# Altium schematic sheet Power.SchDoc: Power
size A4; Organization: Altium Limited; Address1: L3, 12a Rodborough Rd; Address2: Frenchs Forest; Address3: NSW; Address4: Australia 2086
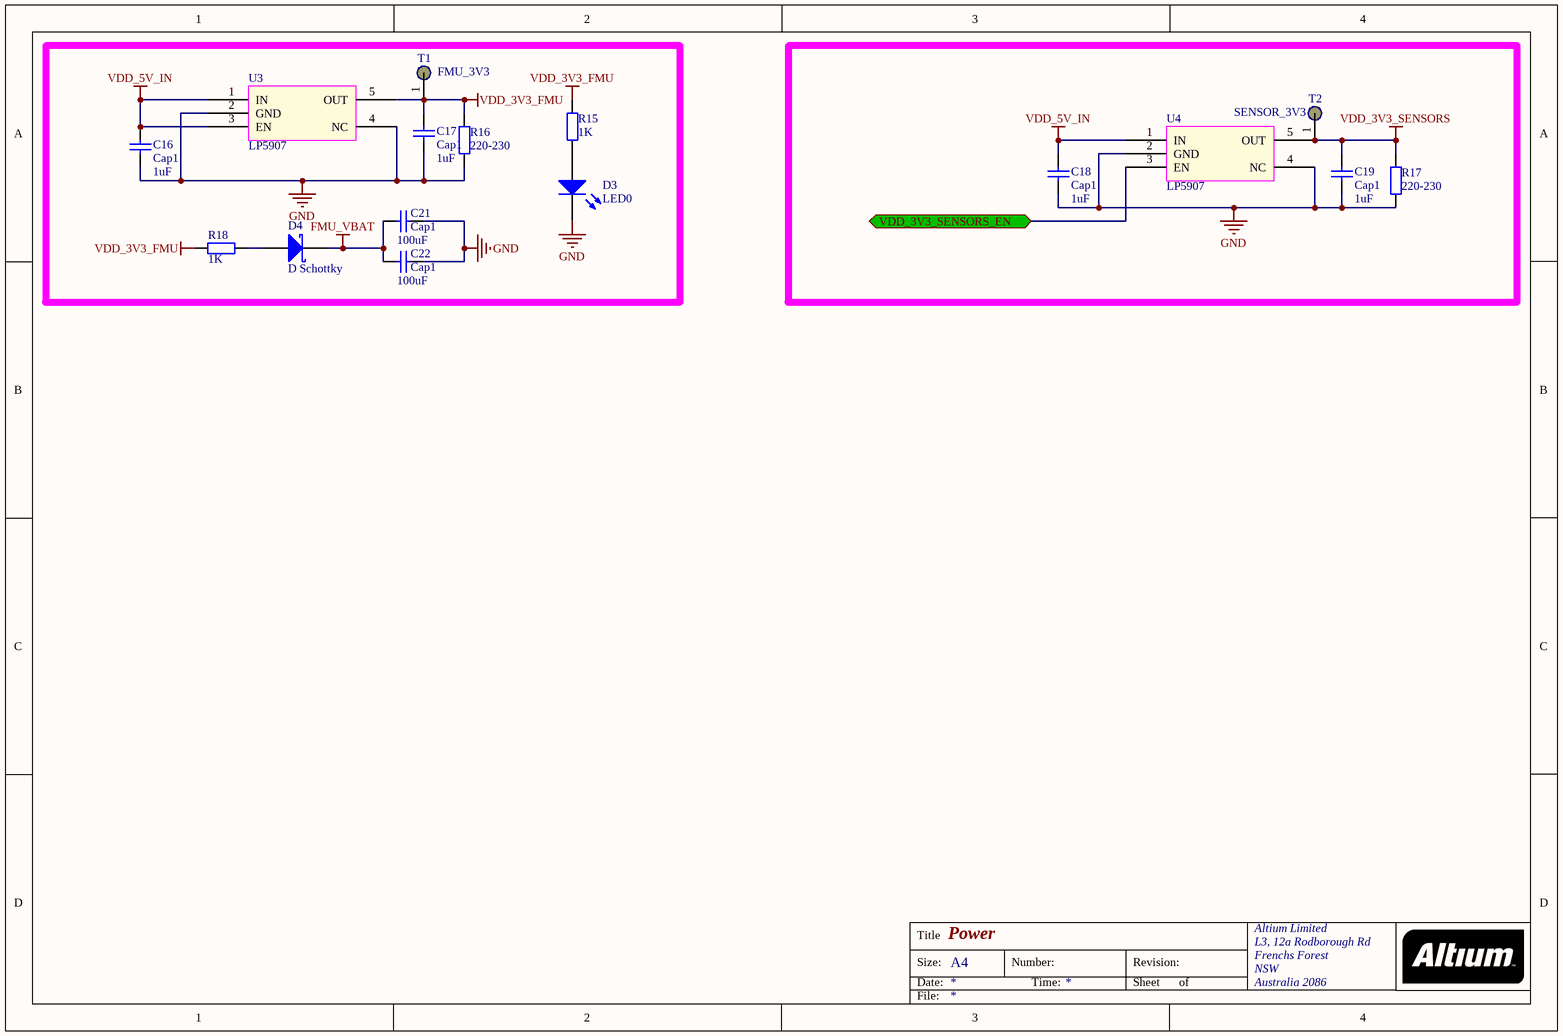
[diagram p0: Power.SchDoc]

## Parts
C16  Cap1  value 1uF  [0603AC]
C17  Cap1  value 1uF  [0603AC]
C18  Cap1  value 1uF  [0603AC]
C19  Cap1  value 1uF  [0603AC]
C21  Cap1  value 100uF  [0805C]
C22  Cap1  value 100uF  [0805C]
D3  LED0  [LED_R]
D4  D Schottky  [DO-214]
R15  value 1K  [0603AR]  (hidden comment: Resist)
R16  value 220-230  [0603AR]  (hidden comment: Resist)
R17  value 220-230  [0603AR]  (hidden comment: Resist)
R18  value 1K  [0603AR]  (hidden comment: Resist)
T1  FMU_3V3  [TAB]
T2  SENSOR_3V3  [TAB]
U3  LP5907
U4  LP5907

## Ports
VDD_3V3_SENSORS_EN

## Nets
FMU_VBAT: C21.2 C22.2 D4.2(K)
GND: C16.1 C17.1 C18.1 C19.1 C21.1 C22.1 D3.2(K) R16.1 R17.1 U3.2(GND) U3.4(NC) U4.2(GND) U4.4(NC)
VDD_3V3_FMU: C17.2 R15.2 R16.2 R18.2 T1.1 U3.5(OUT)
VDD_3V3_SENSORS: C19.2 R17.2 T2.1 U4.5(OUT)
VDD_5V_IN: C16.2 C18.2 U3.1(IN) U3.3(EN) U4.1(IN)
VDD_3V3_SENSORS_EN: U4.3(EN) ; port VDD_3V3_SENSORS_EN
NetD3_1: D3.1(A) R15.1
NetD4_1: D4.1(A) R18.1

## Notes on the sheet
- Title
- Size:
- Date:
- A4
- Number:
- Time:
- Revision:
- Sheet
- of
- File:

## Library data of the parts
C16-C19 C21 C22 = Cap1: Capacitor; Published: 8-Jun-2000; LatestRevisionDate: 17-Jul-2002; LatestRevisionNote: Re-released for DXP Platform.; PackageReference: RAD-0.3; Publisher: Altium Limited; PackageDescription: Radial Cap, Thru-Hole; 2 Leads; 0.3 in Pin Spacing
D3 = LED0: Typical INFRARED GaAs LED; Published: 8-Jun-2000; LatestRevisionDate: 08-Jul-2005; LatestRevisionNote: Mech Layer 1 removed.; PackageReference: LED-0; Publisher: Altium Limited; PackageDescription: LED; 2 Leads
D4 = D Schottky: Schottky Diode; Published: 8-Jun-2000; LatestRevisionDate: 17-Jul-2002; LatestRevisionNote: Re-released for DXP Platform.; PackageReference: SMB; Publisher: Altium Limited; PackageDescription: DO-214-AA/SMB; 2 C-Bend Leads; Body 5.3 x 3.6 mm, inc. leads (LxW); Code_JEDEC: DO-214-AA
R15-R18 = Res
T1 T2 = Tap